# EAGLE design sensor (EAGLE 6.1)
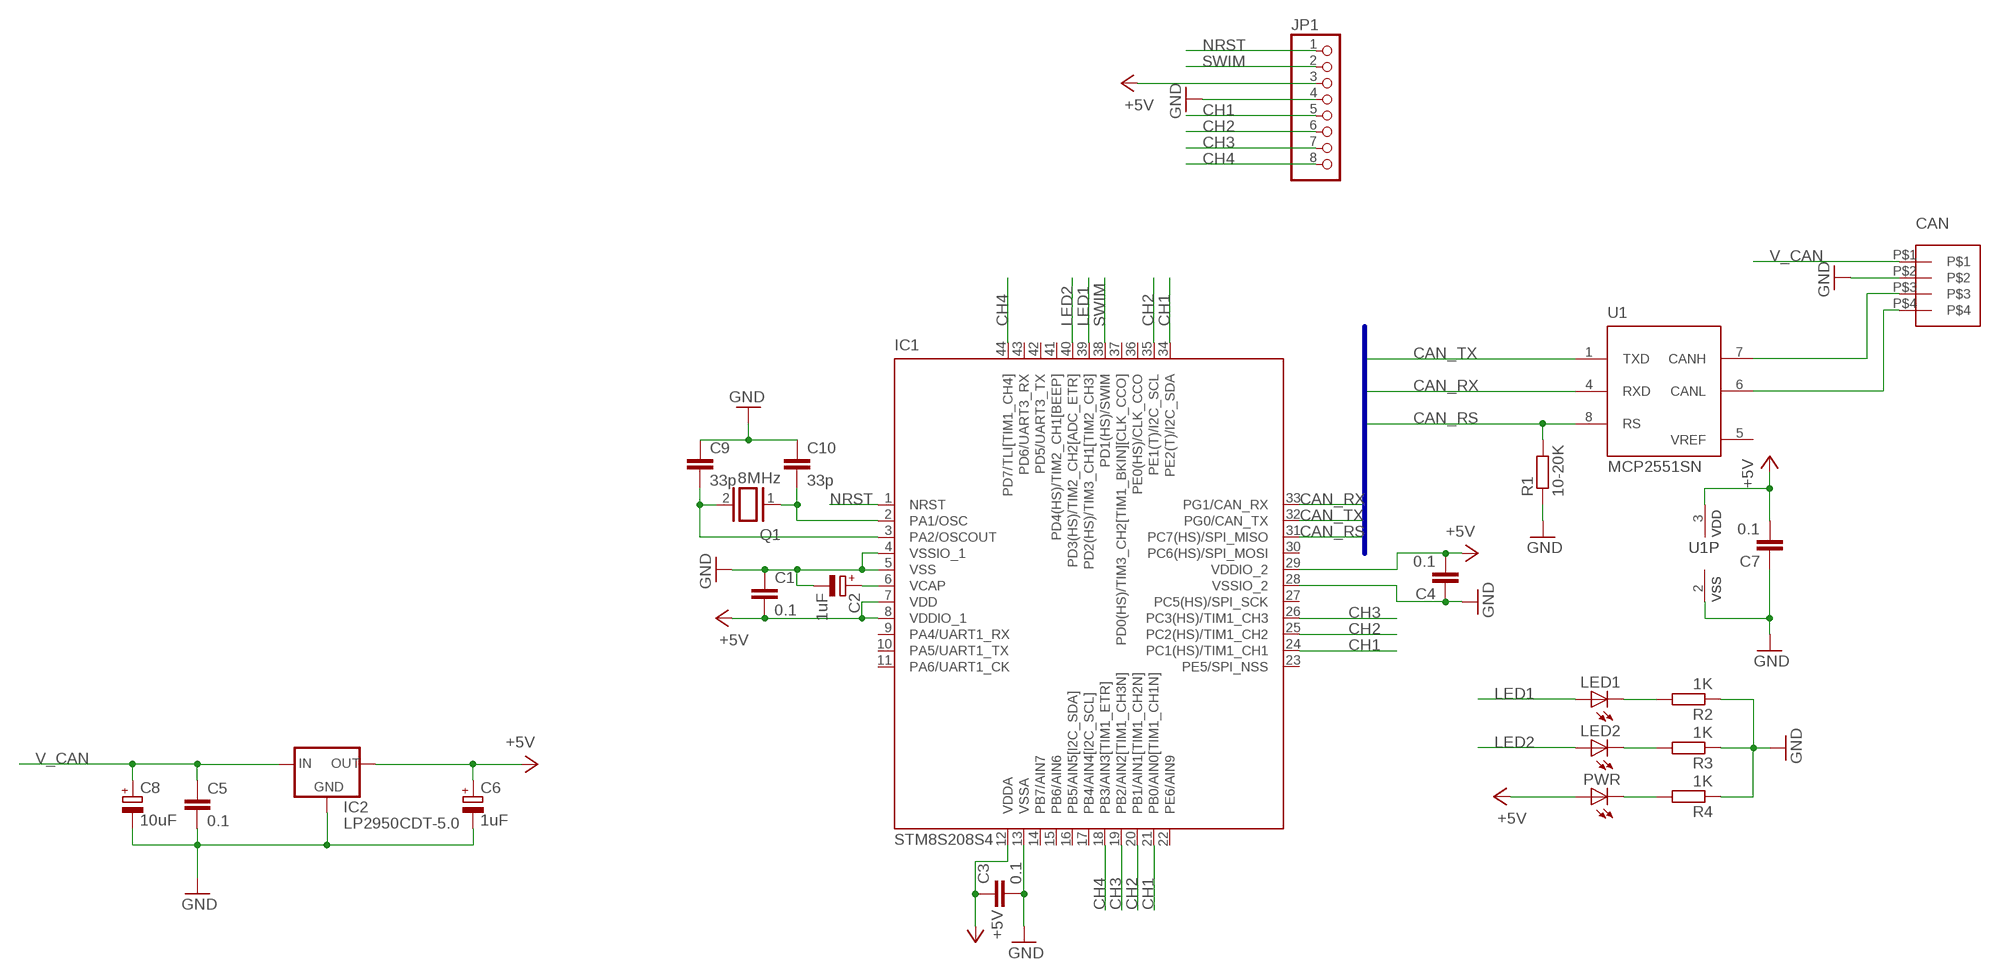
[diagram p0: schematic, sheet 1]

## Parts
C1  0.1  C-EUC0805K  [C0805K]
C2  1uF  CPOL-EUE2-4  [E2-4]
C3  0.1  C-EUC0805K  [C0805K]
C4  0.1  C-EUC0805K  [C0805K]
C5  0.1  C-EUC0805K  [C0805K]
C6  1uF  CPOL-EUE2-4  [E2-4]
C7  0.1  C-EUC0805K  [C0805K]
C8  10uF  CPOL-EUE2-4  [E2-4]
C9  33p  C-EUC0805K  [C0805K]
C10  33p  C-EUC0805K  [C0805K]
CAN  CWF-4R  [CWF-4R]
IC1  STM8S208S4  [LQFP44-10X10]
IC2  LP2950CDT-5.0  [DPACK]
JP1  PINHD-1X8/90  [1X08/90]
LED1  LEDSML0805  [SML0805]
LED2  LEDSML0805  [SML0805]
PWR  LEDSML0805  [SML0805]
Q1  8MHz  XTAL/S  [QS]
R1  10-20K  R-EU_R0805  [R0805]
R2  1K  R-EU_R0805  [R0805]
R3  1K  R-EU_R0805  [R0805]
R4  1K  R-EU_R0805  [R0805]
U1  MCP2551SN  [SO-08]

## Nets
+5V: C1.2 C3.1 C4.2 C6.+ C7.2 IC1.7(VDD) IC1.8(VDDIO_1) IC1.12(VDDA) IC1.29(VDDIO_2) IC2.3(OUT) JP1.3 PWR.A U1.3(VDD)
CAN_RS: IC1.31(PC7(HS)/SPI_MISO) R1.2 U1.8(RS)
CAN_RX: IC1.33(PG1/CAN_RX) U1.4(RXD)
CAN_TX: IC1.32(PG0/CAN_TX) U1.1(TXD)
CH1: IC1.21(PB0/AIN0[TIM1_CH1N]) IC1.24(PC1(HS)/TIM1_CH1) IC1.34(PE2(T)/I2C_SDA) JP1.5
CH2: IC1.20(PB1/AIN1[TIM1_CH2N]) IC1.25(PC2(HS)/TIM1_CH2) IC1.35(PE1(T)/I2C_SCL) JP1.6
CH3: IC1.19(PB2/AIN2[TIM1_CH3N]) IC1.26(PC3(HS)/TIM1_CH3) JP1.7
CH4: IC1.18(PB3/AIN3[TIM1_ETR]) IC1.44(PD7/TLI[TIM1_CH4]) JP1.8
GND: C1.1 C2.- C3.2 C4.1 C5.2 C6.- C7.1 C8.- C9.1 C10.1 CAN.P$2 IC1.4(VSSIO_1) IC1.5(VSS) IC1.13(VSSA) IC1.28(VSSIO_2) IC2.4(GND) JP1.4 R1.1 R2.1 R3.1 R4.1 U1.2(VSS)
LED1: IC1.39(PD2(HS)/TIM3_CH1[TIM2_CH3]) LED1.A
LED2: IC1.40(PD3(HS)/TIM2_CH2[ADC_ETR]) LED2.A
N$1: C2.+ IC1.6(VCAP)
N$2: CAN.P$4 U1.6(CANL)
N$3: C10.2 IC1.2(PA1/OSC) Q1.1
N$4: CAN.P$3 U1.7(CANH)
N$5: C9.2 IC1.3(PA2/OSCOUT) Q1.2
N$7: LED1.C R2.2
N$8: LED2.C R3.2
N$9: PWR.C R4.2
NRST: IC1.1(NRST) JP1.1
SWIM: IC1.38(PD1(HS)/SWIM) JP1.2
V_CAN: C5.1 C8.+ CAN.P$1 IC2.1(IN)
Unconnected: IC1.9(PA4/UART1_RX) IC1.10(PA5/UART1_TX) IC1.11(PA6/UART1_CK) IC1.14(PB7/AIN7) IC1.15(PB6/AIN6) IC1.16(PB5/AIN5[I2C_SDA]) IC1.17(PB4/AIN4[I2C_SCL]) IC1.22(PE6/AIN9) IC1.23(PE5/SPI_NSS) IC1.27(PC5(HS)/SPI_SCK) IC1.30(PC6(HS)/SPI_MOSI) IC1.36(PE0(HS)/CLK_CCO) IC1.37(PD0(HS)/TIM3_CH2[TIM1_BKIN][CLK_CCO]) IC1.41(PD4(HS)/TIM2_CH1[BEEP]) IC1.42(PD5/UART3_TX) IC1.43(PD6/UART3_RX)

## Buses
CAN_TX,CAN_RX,CAN_RS

## Power pins joined to a net without a drawn wire
VREF: U1.5(VREF)

## Library data of the parts
C1 C3-C5 C7 C9 C10 = rcl:C-EU: CAPACITOR, European symbol
C2 C6 C8 = rcl:CPOL-EU: POLARIZED CAPACITOR, European symbol
CAN = connector:CWF-4R: CWF-4R male right angle connector
IC1 = stm8s208s:STM8S208S: Access line, 16 MHz STM8S 8-bit MCU up to 32 Kbytes Flash, integrated EEPROM,10-bit ADC, timers, UART, SPI, I²C Source: Data sheet <http://www.st.com/stonline/products/literature/ds/14771/stm8s105c4.pdf>; MPN: STM8S208S; OC_FARNELL: 1706227; OC_NEWARK: 09R6037
IC2 = v-reg:LP2950?*: Source: http://cache.national.com/ds/LP/LP2950.pdf
JP1 = pinhead:PINHD-1X8: PIN HEADER
LED1 LED2 PWR = led:LED: LED OSRAM: - CHIPLED LG R971, LG N971, LY N971, LG Q971, LY Q971, LO R971, LY R971 LH N974, LH R974 LS Q976, LO Q976, LY Q976 LO Q996 - Hyper CHIPLED LW Q18S LB Q993, LB Q99A, LB R99A - SideLED LS A670, LO A670, LY A670, LG A670, LP A670 LB A673, LV A673, LT A673, LW A673 LH A674 LY A675 LS A676, LA A676, LO A676, LY A676, LW A676 LS A679, LY A679, LG A679 - Hyper Micro SIDELED® LS Y876, LA Y876, LO Y876, LY Y876 LT Y87S - SmartLED LW L88C, LW L88S LB L89C, LB L89S, LG L890 LS L89K, LO L89K, LY L89K LS L896, LA L896, LO L896, LY L896 - TOPLED LS T670, LO T670, LY T670, LG T670, LP T670 LSG T670, LSP T670, LSY T670, LOP T670, LYG T670 LG T671, LOG T671, LSG T671 LB T673, LV T673, LT T673, LW T673 LH T674 LS T676, LA T676, LO T676, LY T676, LB T676, LH T676, LSB T676, LW T676 LB T67C, LV T67C, LT T67C, LS T67K, LO T67K, LY T67K, LW E67C LS E67B, LA E67B, LO E67B, LY E67B, LB E67C, LV E67C, LT E67C LW T67C LS T679, LY T679, LG T679 LS T770, LO T770, LY T770, LG T770, LP T770 LB T773, LV T773, LT T773, LW T773 LH T774 LS E675, LA E675, LY E675, LS T675 LS T776, LA T776, LO T776, LY T776, LB T776 LHGB T686 LT T68C, LB T68C - Hyper Mini TOPLED® LB M676 - Mini TOPLED Santana® LG M470 LS M47K, LO M47K, LY M47K Source: http://www.osram.convergy.de LUXEON: - LUMILED® LXK2-PW12-R00, LXK2-PW12-S00, LXK2-PW14-U00, LXK2-PW14-V00 LXK2-PM12-R00, LXK2-PM12-S00, LXK2-PM14-U00 LXK2-PE12-Q00, LXK2-PE12-R00, LXK2-PE12-S00, LXK2-PE14-T00, LXK2-PE14-U00 LXK2-PB12-K00, LXK2-PB12-L00, LXK2-PB12-M00, LXK2-PB14-N00, LXK2-PB14-P00, LXK2-PB14-Q00 LXK2-PR12-L00, LXK2-PR12-M00, LXK2-PR14-Q00, LXK2-PR14-R00 LXK2-PD12-Q00, LXK2-PD12-R00, LXK2-PD12-S00 LXK2-PH12-R00, LXK2-PH12-S00 LXK2-PL12-P00, LXK2-PL12-Q00, LXK2-PL12-R00 Source: www.luxeon.com KINGBRIGHT: KA-3528ASYC Source: www.kingbright.com
Q1 = special:XTAL/S: CRYSTAL
R1-R4 = rcl:R-EU_: RESISTOR, European symbol
U1 = microchip_can:MCP2551: High Speed CAN tranceiver

## Board
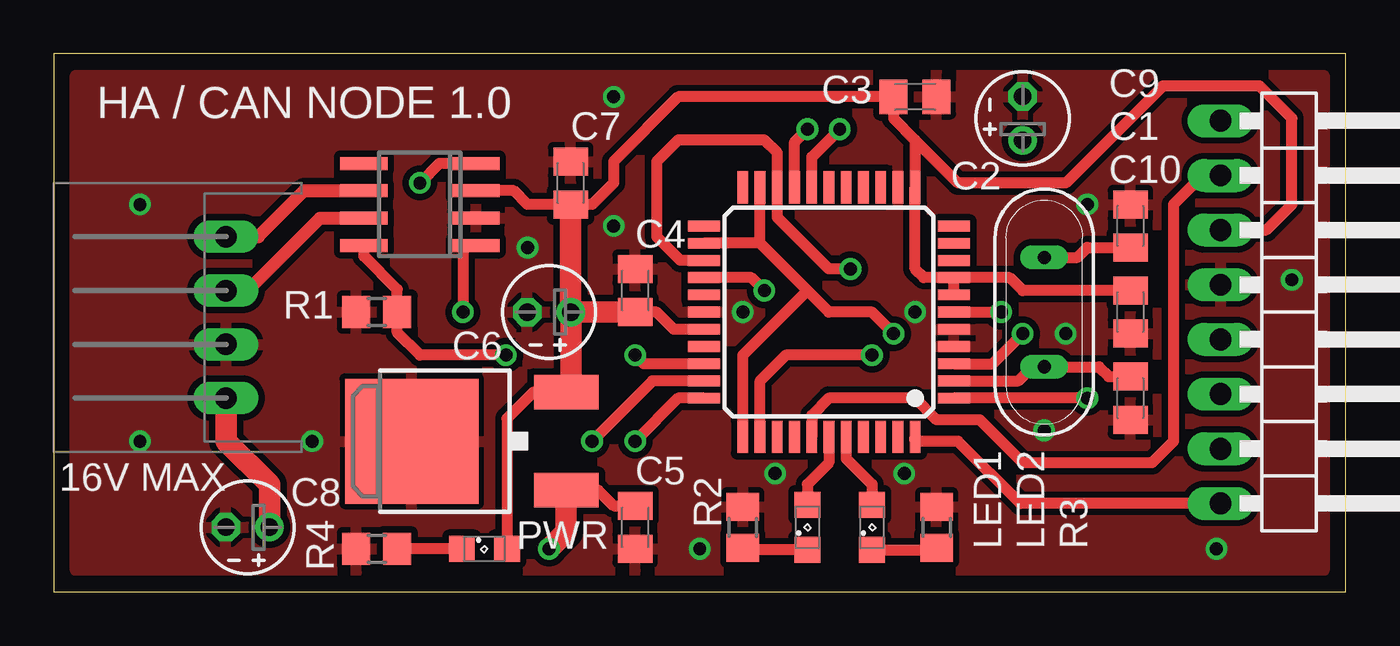
[diagram p1: board, top side]
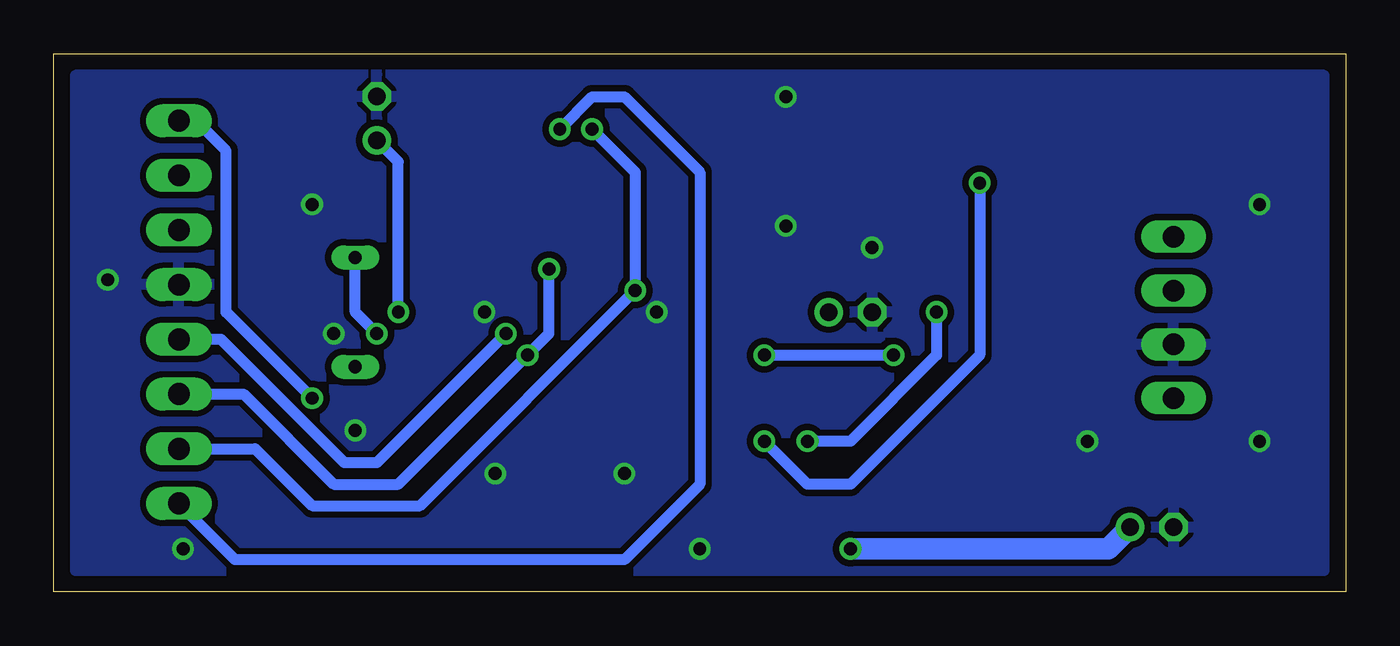
[diagram p2: board, bottom side, seen from below]

Size 60 x 25 mm. Coordinates in mm from the lower left corner, seen from the top.
Outline: 0,0 60,0 60,25 0,25 0,0
Copper layers (1*16): Top 0.018mm / dielectric 1.5mm / Bottom 0.018mm
Design rules: minimum track width 0.3mm, minimum drill 0.4mm, track to track 0.3mm, track to pad 0.3mm, pad to pad 0.3mm, via to via 0.3mm, smd to smd 0.3mm, copper to edge 0.5mm, drill to drill 0.5mm, minimum pad ring 10mil, minimum via ring 8mil, stop-mask expansion 0.1mm, vias tented up to drill 0mil, thermal gap 10mil

### Footprints (pad centres in the part's own frame; a part is rotated, then mirrored left to right if it is on the bottom)
C0805K = smd 1.3 x 1.6: 1 -1,0; 2 1,0
E2-4 = drill 0.813 pad 1.27: + -1.016,0 | drill 0.813 pad 1.27 octagon: - 1.016,0
CWF-4R = drill 1 long: P$1 -1,4; P$2 -1,1.5; P$3 -1,-1; P$4 -1,-3.5
LQFP44-10X10 = smd 1.5 x 0.5: 1 -5.8,4; 2 -5.8,3.2; 3 -5.8,2.4; 4 -5.8,1.6; 5 -5.8,0.8; 6 -5.8,0; 7 -5.8,-0.8; 8 -5.8,-1.6; 9 -5.8,-2.4; 10 -5.8,-3.2; 11 -5.8,-4; 23 5.8,-4; 24 5.8,-3.2; 25 5.8,-2.4; 26 5.8,-1.6; 27 5.8,-0.8; 28 5.8,0; 29 5.8,0.8; 30 5.8,1.6; 31 5.8,2.4; 32 5.8,3.2; 33 5.8,4 | smd 0.5 x 1.5: 12 -4,-5.8; 13 -3.2,-5.8; 14 -2.4,-5.8; 15 -1.6,-5.8; 16 -0.8,-5.8; 17 0,-5.8; 18 0.8,-5.8; 19 1.6,-5.8; 20 2.4,-5.8; 21 3.2,-5.8; 22 4,-5.8; 34 4,5.8; 35 3.2,5.8; 36 2.4,5.8; 37 1.6,5.8; 38 0.8,5.8; 39 0,5.8; 40 -0.8,5.8; 41 -1.6,5.8; 42 -2.4,5.8; 43 -3.2,5.8; 44 -4,5.8
DPACK = smd 1.6 x 3: 1 -2.28,-4.8; 3 2.28,-4.8 | smd 5.8 x 6.2: 4 0,2.38
1X08/90 = drill 1.016 long: 1 -8.89,-3.81; 2 -6.35,-3.81; 3 -3.81,-3.81; 4 -1.27,-3.81; 5 1.27,-3.81; 6 3.81,-3.81; 7 6.35,-3.81; 8 8.89,-3.81
SML0805 = smd 1.2 x 1.2: A 1.05,0; C -1.05,0
QS = drill 0.61 long: 1 -2.54,0; 2 2.54,0
R0805 = smd 1.3 x 1.5: 1 -0.95,0; 2 0.95,0
SO-08 = smd 0.6 x 2.2: 1 -1.905,-2.6; 2 -0.635,-2.6; 3 0.635,-2.6; 4 1.905,-2.6; 5 1.905,2.6; 6 0.635,2.6; 7 -0.635,2.6; 8 -1.905,2.6

### Placement (x,y rotation side)
C1  50,13 90 top
C2  45,22 90 top
C3  40,23 0 top
C4  27,14 270 top
C5  27,3 270 top
C6  23,13 180 top
C7  24,19 270 top
C8  9,3 180 top
C9  50,17 270 top
C10  50,9 90 top
CAN  7,13 180 top
IC1  36,13 180 top
IC2  19,7 90 top
JP1  58,13 270 top
LED1  35,3 90 top
LED2  38,3 90 top
PWR  20,2 0 top
Q1  46,13 90 top
R1  15,13 0 top
R2  32,3 270 top
R3  41,3 270 top
R4  15,2 0 top
U1  17,18 90 top

### Tracks (layer width: path | path; a pad name or v marks a point on that pad's centre or on a via)
+5V
  Top 0.5: IC2.3 22.28,9.28 21.05,8.05 PWR.A | IC1.7 IC1.8 | U1.3 21.36,18.64 22,18 C7.2 25,18 26,19 26,20 29,23 C3.1 39,22 40,21 | IC1.29 28.8,12.2 28,13 C4.2 | C1.2 45,14 44.4,14.6 IC1.8 | 40,21 IC1.12 40,15 40.4,14.6 IC1.8 | JP1.3 56.31,16.81 57.5,18 57.5,22 56,23.5 51.5,23.5 47,19 42,19 40,21
  Top 1: IC2.3 24.02,9.5 C6.+ | C6.+ 24,13.02 C7.2 | C4.2 C6.+
CAN_RS  (via drill 0.6)
  Top 0.5: IC1.31 27.4,10.6 v27,11 | U1.8 14.4,15.6 15.95,14.05 R1.2 15.95,12.05 17,11 v21,11
  Bottom 0.5: v27,11 v21,11
CAN_RX  (via drill 0.6)
  Top 0.5: IC1.33 29,9 v27,7 | U1.4 17.91,19.91 v17,19
  Bottom 0.5: v17,19 17,11 23,5 25,5 v27,7
CAN_TX  (via drill 0.6)
  Top 0.5: IC1.32 27.8,9.8 v25,7 | U1.1 19,16.09 v19,13
  Bottom 0.5: v19,13 19,11 23,7 v25,7
CH1  (via drill 0.6)
  Top 0.5: 35,14 36,13 38,13 v39,12 | 35,14 32.8,16.2 | 32.8,16.2 IC1.21 | 32.8,16.2 IC1.24 | IC1.34 32,11 35,14
  Bottom 0.5: v39,12 45,6 46.5,6 52.23,11.73 JP1.5
CH2  (via drill 0.6)
  Top 0.5: v37,15 36,15 33.6,17.4 IC1.20 33.6,20.4 33,21 29,21 28,20 28,16.5 29.1,15.4 IC1.25 | IC1.35 32.8,9.8 34,11 v38,11
  Bottom 0.5: v37,15 37,12 v38,11 44,5 47,5 51.19,9.19 JP1.6
CH3  (via drill 0.6)
  Top 0.5: v33,14 32.4,14.6 IC1.26 | IC1.19 34.4,20.9 v35,21.5
  Bottom 0.5: v35,21.5 33,19.5 v33,14 43,4 48,4 50.65,6.65 JP1.7
CH4  (via drill 0.6)
  Top 0.5: JP1.8 44.89,4.11 42,7 40,7 IC1.44 | IC1.18 35.2,20.2 v36.5,21.5
  Bottom 0.5: 54.08,4 JP1.8 51.58,1.5 33.5,1.5 30,5 30,19.5 33.5,23 35,23 v36.5,21.5
GND  (via drill 0.6)
  other vias: 12,7 32,13 40,13 46,7.5 47,12 26,17 54,2 30,2 26,23 33.5,5.5 39.5,5.5 57.5,14.5 48,18 4,7 4,18 22,16
  pour Top (isolate 0.3): 1,24 59,24 59,1 1,1
  pour Bottom (isolate 0.3): 1,24 59,24 59,1 1,1
LED1
  Top 0.5: IC1.39 36,6 35,5 LED1.A
LED2
  Top 0.5: IC1.40 36.8,6.2 38,5 LED2.A
N$1  (via drill 0.6)
  Top 0.5: IC1.6 v44,13
  Bottom 0.5: v44,13 44,19.98 C2.+
N$2
  Top 0.6: CAN.P$4 9.5,16.5 11.63,18.64 U1.6
N$3
  Top 0.5: C10.2 49,10 48.54,10.46 Q1.1 45.46,10.46 44.8,9.8 IC1.2
N$4
  Top 0.6: CAN.P$3 9,14 12.37,17.36 U1.7
N$5  (via drill 0.6)
  Top 0.5: IC1.3 43.6,10.6 v45,12 | Q1.2 47.54,15.54 48,16 C9.2
  Bottom 0.5: v45,12 46,13 Q1.2
N$7
  Top 0.5: LED1.C 32.1,1.95 R2.2
N$8
  Top 0.5: LED2.C 40.9,1.95 R3.2
N$9
  Top 0.5: PWR.C R4.2
NRST  (via drill 0.6)
  Top 0.5: v48,9 IC1.1
  Bottom 0.5: JP1.1 53.39,21.89 52,20.5 52,13 v48,9
SWIM
  Top 0.5: JP1.2 53.35,19.35 52,18 52,7 51,6 45,6 43,8 41,8 40,9 36,9 35.2,8.2 IC1.38
V_CAN  (via drill 0.6)
  Top 0.5: IC2.1 25.28,4.72 26,4 C5.1
  Top 1: CAN.P$1 8,7 10.02,4.98 C8.+ | IC2.1 23.8,2.8 v23,2
  Bottom 1: v23,2 11.02,2 C8.+

### Text on the board
tNames: HA / CAN NODE 1.0 | 16V MAX